# Altium schematic sheet US_EPS_BR.SchDoc
size A3
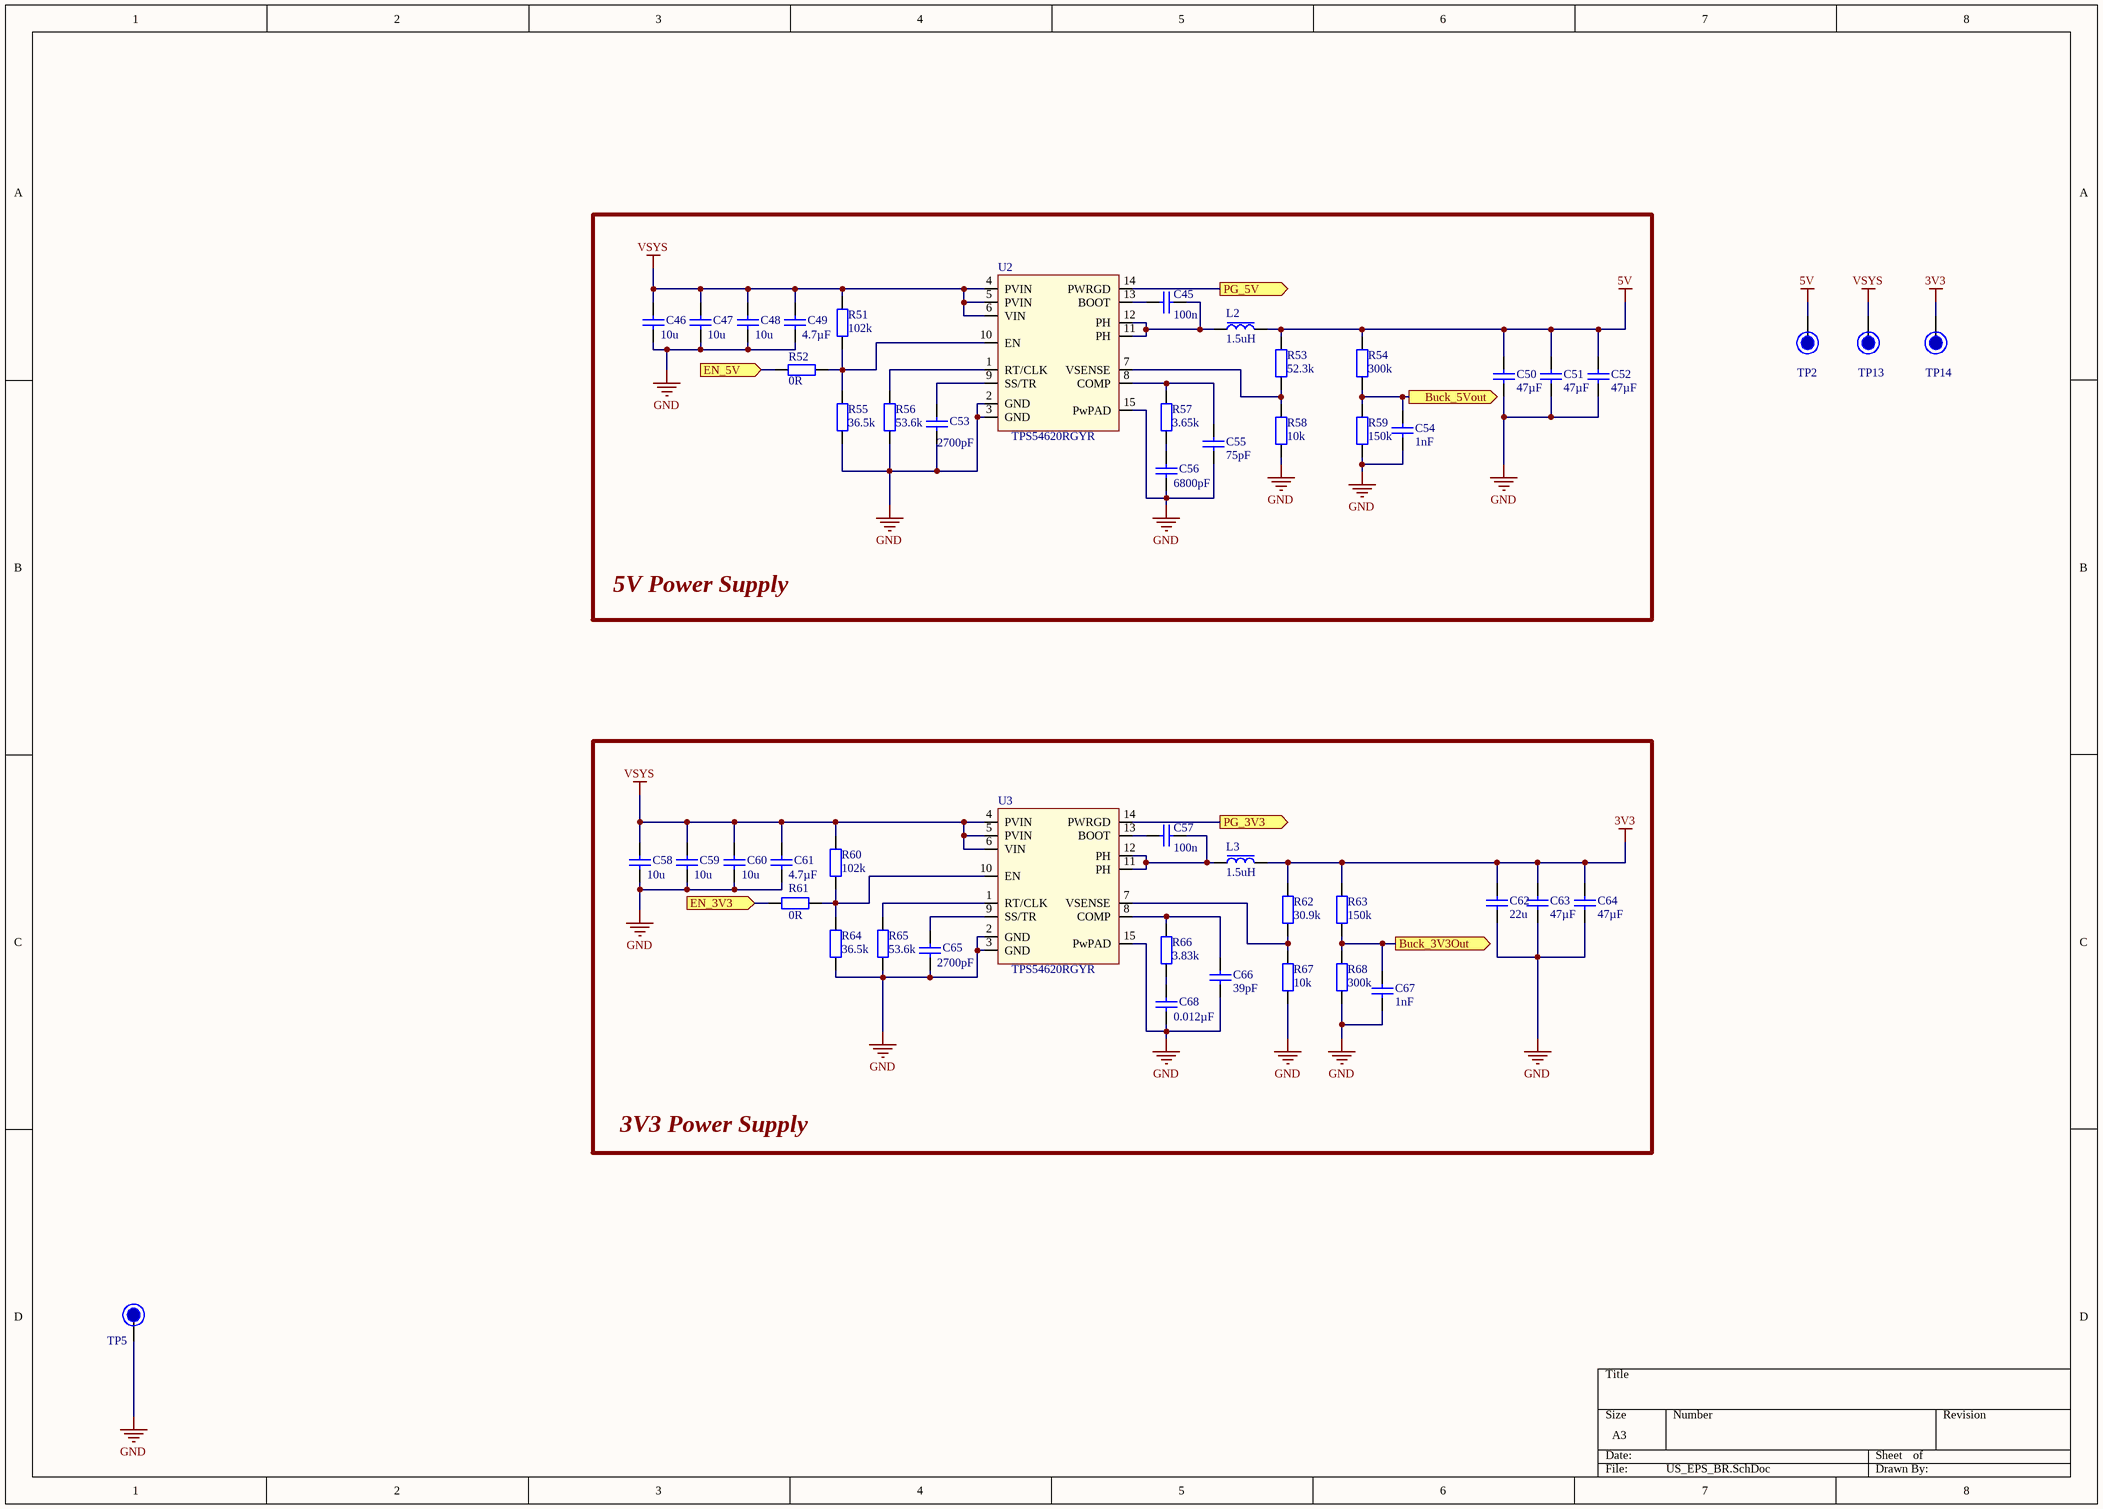
[diagram p0: US_EPS_BR.SchDoc]

## Parts
C45  100n  [C0603_IPC_HD]
C46  10u  [C0805_IPC_HD]
C47  10u  [C0805_IPC_HD]
C48  10u  [C0805_IPC_HD]
C49  4.7µF  [C0603_IPC_MD]
C50  47µF  [C1206_IPC_HD]
C51  47µF  [C1206_IPC_HD]
C52  47µF  [C1206_IPC_HD]
C53  2700pF  [C0603_IPC_HD]
C54  1nF  [C0603_IPC_HD]
C55  75pF  [C0603_IPC_HD]
C56  6800pF  [C0603_IPC_HD]
C57  100n  [C0603_IPC_HD]
C58  10u  [C0805_IPC_HD]
C59  10u  [C0805_IPC_HD]
C60  10u  [C0805_IPC_HD]
C61  4.7µF  [C0603_IPC_MD]
C62  22u  [C0805_IPC_HD]
C63  47µF  [C1206_IPC_HD]
C64  47µF  [C1206_IPC_HD]
C65  2700pF  [C0603_IPC_HD]
C66  39pF  [C0603_IPC_HD]
C67  1nF  [C0603_IPC_HD]
C68  0.012µF  [C0603_IPC_HD]
L2  1.5uH  [INDP8687X40N-(VLP8040 )]
L3  1.5uH  [INDP8687X40N-(VLP8040 )]
R51  102k  [C0603_IPC_HD]
R52  0R  [R0603_IPC_MD]
R53  52.3k  [C0603_IPC_HD]
R54  300k  [R0603_IPC_MD]
R55  36.5k  [C0603_IPC_HD]
R56  53.6k  [C0603_IPC_HD]
R57  3.65k  [C0603_IPC_HD]
R58  10k  [C0603_IPC_HD]
R59  150k  [R0603_IPC_MD]
R60  102k  [C0603_IPC_HD]
R61  0R  [R0603_IPC_MD]
R62  30.9k  [C0603_IPC_HD]
R63  150k  [R0603_IPC_MD]
R64  36.5k  [C0603_IPC_HD]
R65  53.6k  [C0603_IPC_HD]
R66  3.83k  [C0603_IPC_HD]
R67  10k  [C0603_IPC_HD]
R68  300k  [R0603_IPC_MD]
TP2  Test Point  [TestPoint_1M5]  (value not drawn)  (no BOM)
TP5  Test Point  [TestPoint_1M5]  (value not drawn)  (no BOM)
TP13  Test Point  [TestPoint_1M5]  (value not drawn)  (no BOM)
TP14  Test Point  [TestPoint_1M5]  (value not drawn)  (no BOM)
U2  TPS54620RGYR  [14-VFQFN-(TPS54620RGYR)]
U3  TPS54620RGYR  [14-VFQFN-(TPS54620RGYR)]

## Blocks framed on the sheet
5V Power Supply: C45-C56 L2 R51-R59 U2
3V3 Power Supply: C57-C68 L3 R60-R68 U3

## Ports
Buck_3V3Out (out), Buck_5Vout (out), EN_3V3 (in), EN_5V (in), PG_3V3 (out), PG_5V (out)

## Nets
3V3: C62.2 C63.2 C64.2 L3.2 R62.2 R63.2 TP14.0
5V: C50.2 C51.2 C52.2 L2.2 R53.2 R54.2 TP2.0
GND: C46.1 C47.1 C48.1 C49.1 C50.1 C51.1 C52.1 C53.1 C54.1 C55.1 C56.1 C58.1 C59.1 C60.1 C61.1 C62.1 C63.1 C64.1 C65.1 C66.1 C67.1 C68.1 R55.1 R56.1 R58.1 R59.1 R64.1 R65.1 R67.1 R68.1 TP5.0 U2.2(GND) U2.3(GND) U2.15(PwPAD) U3.2(GND) U3.3(GND) U3.15(PwPAD)
VSYS: C46.2 C47.2 C48.2 C49.2 C58.2 C59.2 C60.2 C61.2 R51.2 R60.2 TP13.0 U2.4(PVIN) U2.5(PVIN) U2.6(VIN) U3.4(PVIN) U3.5(PVIN) U3.6(VIN)
Buck_3V3Out: C67.2 R63.1 R68.2 ; port Buck_3V3Out
Buck_5Vout: C54.2 R54.1 R59.2 ; port Buck_5Vout
EN_3V3: R61.2 ; port EN_3V3
EN_5V: R52.2 ; port EN_5V
PG_3V3: U3.14(PWRGD) ; port PG_3V3
PG_5V: U2.14(PWRGD) ; port PG_5V
NetC45_1: C45.1 L2.1 U2.11(PH) U2.12(PH)
NetC45_2: C45.2 U2.13(BOOT)
NetC53_2: C53.2 U2.9(SS/TR)
NetC55_2: C55.2 R57.2 U2.8(COMP)
NetC56_2: C56.2 R57.1
NetC57_1: C57.1 L3.1 U3.11(PH) U3.12(PH)
NetC57_2: C57.2 U3.13(BOOT)
NetC65_2: C65.2 U3.9(SS/TR)
NetC66_2: C66.2 R66.2 U3.8(COMP)
NetC68_2: C68.2 R66.1
NetR51_1: R51.1 R52.1 R55.2 U2.10(EN)
NetR53_1: R53.1 R58.2 U2.7(VSENSE)
NetR56_2: R56.2 U2.1(RT/CLK)
NetR60_1: R60.1 R61.1 R64.2 U3.10(EN)
NetR62_1: R62.1 R67.2 U3.7(VSENSE)
NetR65_2: R65.2 U3.1(RT/CLK)

## Library data of the parts
C45 C57 = CL10B104KO8NNNC: CAP CER 0.1UF 16V X7R 0603; Manufacturer: Samsung Electro-Mechanics; Manufacturer Part Number: CL10B104KO8NNNC; Voltage: 16V; Value: 100n; Dielectric: X7R; Supplier 1: Digi-Key; Supplier Part Number 1: 1276-1005-1-ND
C46-C48 C58-C60 = CL21B106KOQNNNG: CAP CER 10UF 16V X7R 0805; Manufacturer: Samsung Electro-Mechanics; Manufacturer Part Number: CL21B106KOQNNNG; Voltage: 16V; Value: 10u; Dielectric: X7R; Supplier 1: Digi-Key; Supplier Part Number 1: 1276-6472-1-ND
C49 C61 = CL0603_4.7uF_10V: 4.7µF ±10% 10V Ceramic Capacitor X5R 0603 (1608 Metric); Manufacturer: Samsung Electro-Mechanics; Manufacturer Part Number: CL10A475KP8NNNC; Dielectric: X7R; Voltage: 10V; Value: 4.7µF; Supplier 1: Digi-Key; Supplier Part Number 1: 1276-1044-1-ND
C50-C52 C63 C64 = CL1206_47uF_10V: CAP CER 47UF 10V X5R 1206; Manufacturer: Samsung Electro-Mechanics; Manufacturer Part Number: CL31A476MPHNNNE; Dielectric: X7R; Voltage: 10V; Value: 47µF; Supplier 1: Digi-Key; Supplier Part Number 1: 1276-3063-1-ND
C53 C65 = CL0603_2700pF_50V: CAP CER 2700PF 50V X7R 0603; Manufacturer: Yageo; Manufacturer Part Number: CC0603KRX7R9BB272; Voltage: 50V; Value: 2700pF; Dielectric: X7R; Supplier 1: Digi-Key; Supplier Part Number 1: 311-1809-1-ND
C54 C67 = CL0603_1nF_0603: CAP CER 1000PF 50V X7R 0603; Manufacturer: Samsung Electro-Mechanics; Manufacturer Part Number: CL10B102KB8NNNC; Voltage: 50V; Value: 1nF; Dielectric: X7R; Supplier 1: Digi-Key; Supplier Part Number 1: 1276-1018-1-ND
C55 = C0603_75pF_50V: CAP CER 75PF 50V C0G/NP0 0603; Manufacturer: Samsung Electro-Mechanics; Manufacturer Part Number: CL10C750JB8NNNC; Dielectric: X7R; Voltage: 50V; Value: 75pF; Supplier 1: Digi-Key; Supplier Part Number 1: 1276-2335-1-ND
C56 = CL0603_6.8nF_50V: CAP CER 6800PF 50V X7R 0603; Manufacturer: TDK Corporation; Manufacturer Part Number: C1608X7R1H682M; Voltage: 50V; Value: 6800pF; Dielectric: X7R; Supplier 1: Digi-Key; Supplier Part Number 1: 445-5088-1-ND
C62 = CL21A226MOCLRNC: CAP CER 22UF 16V X5R 0805; Manufacturer: Samsung Electro-Mechanics; Manufacturer Part Number: CL21A226MOCLRNC; Voltage: 16V; Value: 22u; Dielectric: X5R; Supplier 1: Digi-Key; Supplier Part Number 1: 1276-6780-1-ND
C66 = CL0603_39pF_50V: CAP CER 39PF 50V C0G/NP0 0603; Manufacturer: Samsung Electro-Mechanics; Manufacturer Part Number: CL10C390JB8NNNC; Dielectric: X7R; Voltage: 50V; Value: 39pF; Supplier 1: Digi-Key; Supplier Part Number 1: 1276-1087-1-ND
C68 = C0603_12nF_25V: CAP CER 0.012UF 25V C0G/NP0 0603; Manufacturer: KEMET; Manufacturer Part Number: C0603C123J3GACTU; Dielectric: X7R; Voltage: 25V; Value: 0.012µF; Supplier 1: Digi-Key; Supplier Part Number 1: 399-8997-1-ND
L2 L3 = 1.5µH Shielded Wirewound Inductor 6.7A 13mOhm Max Nonstandard: FIXED IND 1.5UH 6.7A 13 MOHM SMD; Manufacturer: TDK Corporation; Manufacturer Part Number: VLP8040T-1R5N; Value: 1.5uH; Supplier 1: Digi-Key; Supplier Part Number 1: 445-6575-1-ND
R51 R60 = CR0603-JW-102K: RES 102K OHM 1% 1/10W 0603; Manufacturer: KOA Speer Electronics, Inc.; Manufacturer Part Number: RK73H1JTTD1023F; Value: 102k; Tolarance: ±1%; Supplier 1: Digi-Key; Supplier Part Number 1: 2019-RK73H1JTTD1023FCT-ND
R52 R61 = CR0603-J/-000ELF: RES SMD 0 OHM JUMPER 1/10W 0603; Manufacturer: Bourns Inc.; Tolarance: 1%; Value: 0R; Manufacturer Part Number: CR0603-J/-000ELF; Supplier 1: Digi-Key; Supplier Part Number 1: CR0603-J/-000ELFCT-ND
R53 = CR0603-JW-52.3k: RES SMD 52.3K OHM 1% 1/10W 0603; Manufacturer: Yageo; Manufacturer Part Number: RC0603FR-0752K3L; Value: 52.3k; Tolarance: ±1%; Supplier 1: Digi-Key; Supplier Part Number 1: 311-52.3KHRCT-ND
R54 R68 = RC0603FR-07300KL: RES SMD 300K OHM 1% 1/10W 0603; Manufacturer: YAGEO; Value: 300k; Tolarance: 1%; Manufacturer Part Number: RC0603FR-07300KL; Supplier 1: Digi-Key; Supplier Part Number 1: 311-300KHRCT-ND
R55 R64 = CR0603-JW-36.5K: RES 36.5K OHM 1% 1/10W 0603; Manufacturer: KOA Speer Electronics, Inc.; Manufacturer Part Number: RK73H1JTTD3652F; Value: 36.5k; Tolarance: ±1%; Supplier 1: Digi-Key; Supplier Part Number 1: 2019-RK73H1JTTD3652FCT-ND
R56 R65 = CR0603-JW-53.6k: RES 53.6K OHM 1% 1/10W 0603; Manufacturer: KOA Speer Electronics, Inc.; Manufacturer Part Number: RK73H1JTTD5362F; Value: 53.6k; Tolarance: ±1%; Supplier 1: Digi-Key; Supplier Part Number 1: 2019-RK73H1JTTD5362FCT-ND
R57 = CR0603-JW-3.65k: RES SMD 3.65K OHM 1% 1/10W 0603; Manufacturer: Yageo; Manufacturer Part Number: RC0603FR-073K65L; Value: 3.65k; Tolarance: ±1%; Supplier 1: Digi-Key; Supplier Part Number 1: 311-3.65KHRCT-ND
R58 = CR0603-JW-10к: RES 10K OHM 1% 1/10W 0603; Manufacturer: Stackpole Electronics Inc; Manufacturer Part Number: RMCF0603FT10K0; Value: 10k; Tolarance: ±1%; Supplier 1: Digi-Key; Supplier Part Number 1: RMCF0603FT10K0CT-ND
R59 R63 = RC0603FR-07150KL: RES SMD 150K OHM 1% 1/10W 0603; Manufacturer: YAGEO; Value: 150k; Tolarance: 1%; Manufacturer Part Number: RC0603FR-07150KL; Supplier 1: Digi-Key; Supplier Part Number 1: 311-150KHRCT-ND
R62 = CR0603-JW-30.9k: RES SMD 30.9K OHM 1% 1/10W 0603; Manufacturer: Yageo; Manufacturer Part Number: RC0603FR-0730K9L; Value: 30.9k; Tolarance: ±1%; Supplier 1: Digi-Key; Supplier Part Number 1: 311-30.9KHRCT-ND
R66 = CR0603-JW-3.83k: RES SMD 3.83K OHM 1% 1/10W 0603; Manufacturer: Yageo; Manufacturer Part Number: RC0603FR-073K83L; Value: 3.83k; Tolarance: ±1%; Supplier 1: Digi-Key; Supplier Part Number 1: 311-3.83KHRCT-ND
R67 = CR0603-JW-10k: RES 10K OHM 1% 1/10W 0603; Manufacturer: Stackpole Electronics Inc; Manufacturer Part Number: RMCF0603FT10K0; Value: 10k; Tolarance: ±1%; Supplier 1: Digi-Key; Supplier Part Number 1: RMCF0603FT10K0CT-ND
TP2 TP5 TP13 TP14 = TP
U2 U3 = TPS54620RGYR: IC REG BUCK ADJUSTABLE 6A 14VQFN; Manufacturer: Texas Instruments; Manufacturer Part Number: TPS54620RGYR; Supplier 1: Digi-Key; Supplier Part Number 1: 296-24554-1-ND